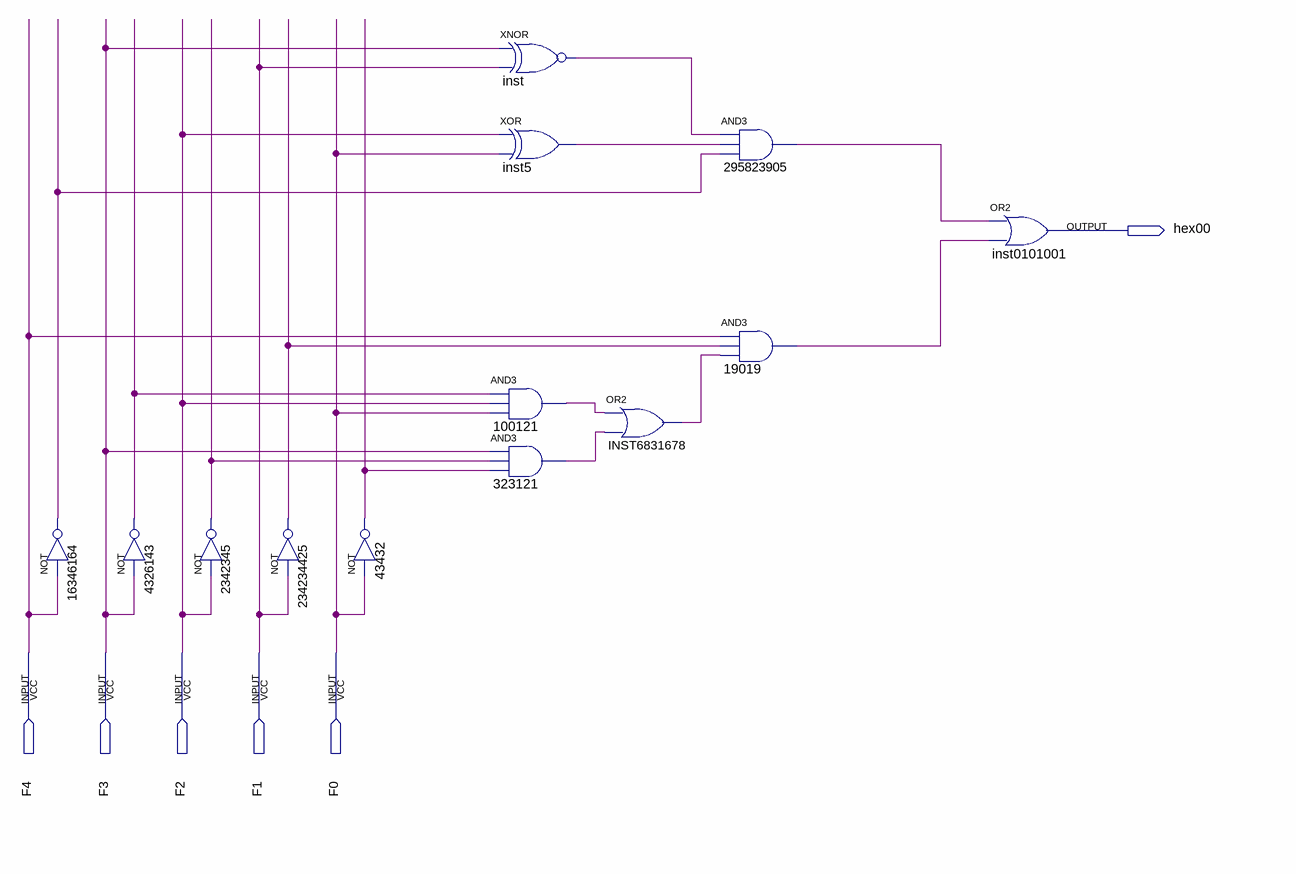
[diagram p0: schematic sheet]
// Quartus schematic HEX0[0].bdf as structural Verilog: 13 symbols, 6 pins
module \HEX0[0]  (
  input  F4,
  input  F3,
  input  F2,
  input  F1,
  input  F0,
  output hex00
);

  wire inst5_out, INST6831678_out, inst_out, n19019_out, n43432_out, n100121_out, n323121_out, n2342345_out,
       n4326143_out, n16346164_out, n234234425_out, n295823905_out;

  not u_16346164 (n16346164_out, F4);
  not u_4326143 (n4326143_out, F3);
  not u_2342345 (n2342345_out, F2);
  not u_234234425 (n234234425_out, F1);
  not u_43432 (n43432_out, F0);
  xnor inst (inst_out, F3, F1);
  xor inst5 (inst5_out, F2, F0);
  and u_100121 (n100121_out, n4326143_out, F2, F0);
  and u_323121 (n323121_out, F3, n2342345_out, n43432_out);
  or INST6831678 (INST6831678_out, n100121_out, n323121_out);
  and u_295823905 (n295823905_out, inst_out, inst5_out, n16346164_out);
  and u_19019 (n19019_out, F4, n234234425_out, INST6831678_out);
  or inst0101001 (hex00, n295823905_out, n19019_out);
endmodule
